# Altium schematic sheet Magnetic_encoder.SchDoc: Smartknob Mag Encoder
size A3; DrawnBy: Mani Magnusson; Revision: 1; SheetNumber: 4; SheetTotal: 5
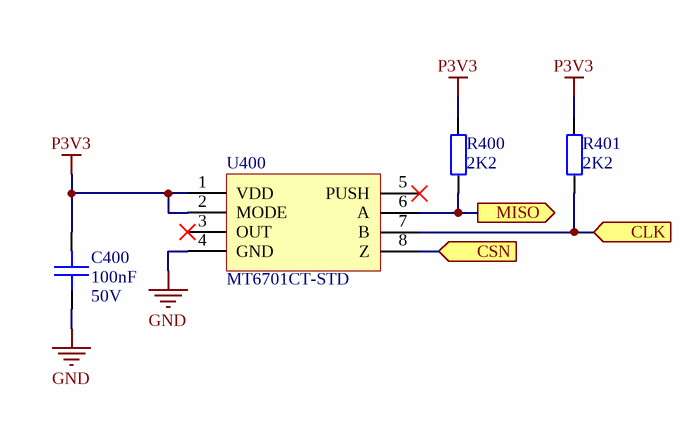
[diagram p0: Magnetic_encoder.SchDoc]

## Parts
C400  value 100nF  Voltage: 50V  [C0402]  (hidden comment: CAP)
R400  value 2K2  [R0402]  (hidden comment: RES)
R401  value 2K2  [R0402]  (hidden comment: RES)
U400  Manufacturer Part No: MT6701CT-STD  [SOP-8]  (hidden comment: MT6701)

## Ports
CLK (in), CSN (in), MISO (out)

## Nets
GND: C400.2 U400.4(GND)
P3V3: C400.1 R400.2 R401.2 U400.1(VDD) U400.2(MODE)
CLK: R401.1 U400.7(B) ; port CLK
CSN: U400.8(Z) ; port CSN
MISO: R400.1 U400.6(A) ; port MISO

Not connected (* = marked no-connect by the designer): U400 3(OUT)* 5(PUSH)*

## Notes on the sheet
- Sheet title:
- Revision:
- Drawn by:
- Date:
- File:

## Library data of the parts
C400 = GRT155R71H104KE01D: General purpose ceramic capacitor; Manufacturer: Murata Electronics; Specification: X7R, 50V, AEC-Q200 Qualified; Ready for use: y; Fitted: Fitted; Package Ref: C0402; Part Reference: GRT155R71H104KE01D; Manufacturer Part No: GRT155R71H104KE01D; Supplier: Digi-Key; Supplier Part No: 490-GRT155R71H104KE01DCT-ND; Generic: Generic
R400 R401 = Generic 0402 resistor: General purpose resistor; Manufacturer Part No: Generic resistor; Ready for use: y; Fitted: Fitted; Package Ref: R0402; Part Reference: Generic 0402 resistor; Manufacturer: N/A; Supplier: N/A; Supplier Part No: N/A; Generic: Generic
U400 = MT6701CT-STD: Hall effect absolute magnetic encoder; Manufacturer: MagnTek; Generic: Non Generic; Ready for use: y; Fitted: Fitted; Package Ref: SOP-8; Part Reference: MT6701CT-STD; Supplier: LCSC; Supplier Part No: C2856764; Type: Sensor